# EAGLE design db9neogeo (EAGLE 9.0.0)
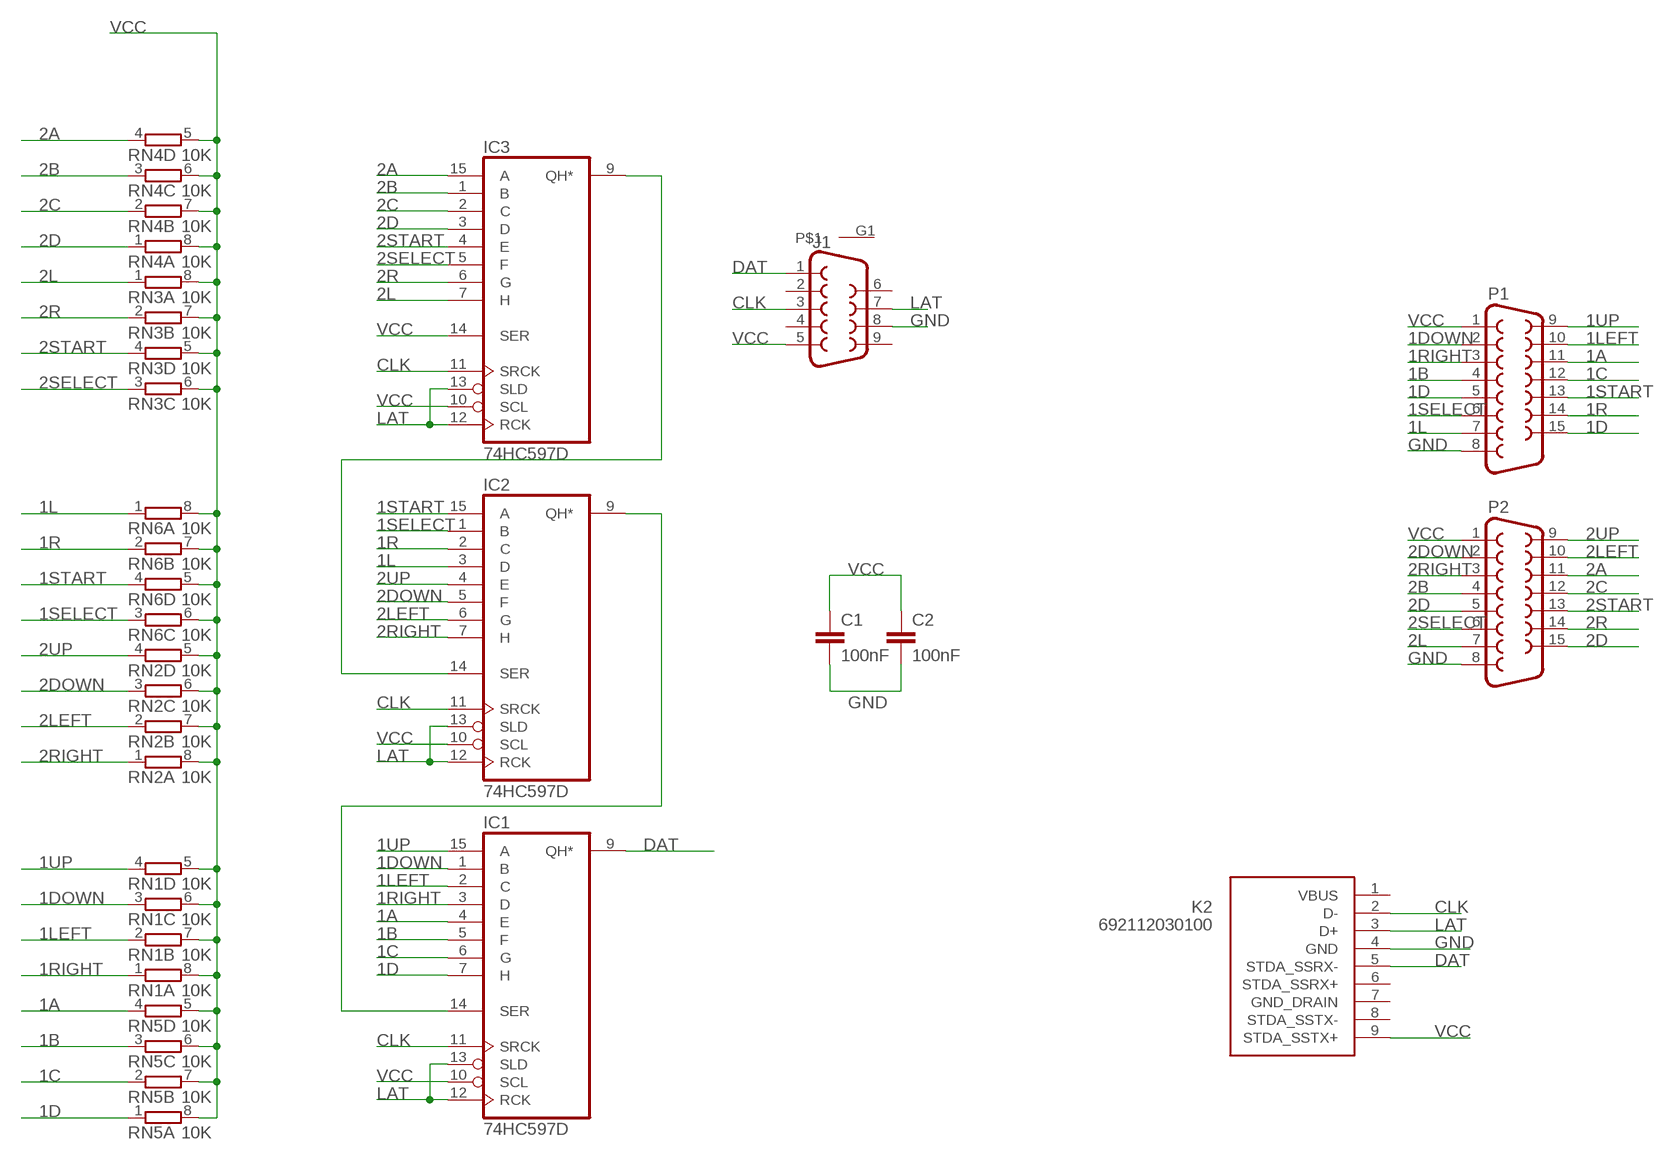
[diagram p0: schematic, sheet 1]

## Parts
C1  100nF  C-EUC0603K  [C0603K]
C2  100nF  C-EUC0603K  [C0603K]
IC1  74HC597D  [SO16]
IC2  74HC597D  [SO16]
IC3  74HC597D  [SO16]
J1  DB9FEMALE  [DB9]
K2  692112030100  [692112030100]
P1  F15HP  [F15HP]
P2  F15HP  [F15HP]
RN1  10K  4R-N0603-ARC  [0603-ARC]
RN2  10K  4R-N0603-ARC  [0603-ARC]
RN3  10K  4R-N0603-ARC  [0603-ARC]
RN4  10K  4R-N0603-ARC  [0603-ARC]
RN5  10K  4R-N0603-ARC  [0603-ARC]
RN6  10K  4R-N0603-ARC  [0603-ARC]

## Nets
1A: IC1.4(E) P1.11 RN5.4
1B: IC1.5(F) P1.4 RN5.3
1C: IC1.6(G) P1.12 RN5.2
1D: IC1.7(H) P1.5 P1.15 RN5.1
1DOWN: IC1.1(B) P1.2 RN1.3
1L: IC2.3(D) P1.7 RN6.1
1LEFT: IC1.2(C) P1.10 RN1.2
1R: IC2.2(C) P1.14 RN6.2
1RIGHT: IC1.3(D) P1.3 RN1.1
1SELECT: IC2.1(B) P1.6 RN6.3
1START: IC2.15(A) P1.13 RN6.4
1UP: IC1.15(A) P1.9 RN1.4
2A: IC3.15(A) P2.11 RN4.4
2B: IC3.1(B) P2.4 RN4.3
2C: IC3.2(C) P2.12 RN4.2
2D: IC3.3(D) P2.5 P2.15 RN4.1
2DOWN: IC2.5(F) P2.2 RN2.3
2L: IC3.7(H) P2.7 RN3.1
2LEFT: IC2.6(G) P2.10 RN2.2
2R: IC3.6(G) P2.14 RN3.2
2RIGHT: IC2.7(H) P2.3 RN2.1
2SELECT: IC3.5(F) P2.6 RN3.3
2START: IC3.4(E) P2.13 RN3.4
2UP: IC2.4(E) P2.9 RN2.4
CLK: IC1.11(SRCK) IC2.11(SRCK) IC3.11(SRCK) J1.3 K2.2(D-)
DAT: IC1.9(QH*) J1.1 K2.5(STDA_SSRX-)
GND: C1.2 C2.2 J1.8 K2.4(GND) P1.8 P2.8
LAT: IC1.12(RCK) IC1.13(SLD) IC2.12(RCK) IC2.13(SLD) IC3.12(RCK) IC3.13(SLD) J1.7 K2.3(D+)
N$1: IC1.14(SER) IC2.9(QH*)
N$7: IC2.14(SER) IC3.9(QH*)
VCC [VCC]: C1.1 C2.1 IC1.10(SCL) IC2.10(SCL) IC3.10(SCL) IC3.14(SER) J1.5 K2.9(STDA_SSTX+) P1.1 P2.1 RN1.5 RN1.6 RN1.7 RN1.8 RN2.5 RN2.6 RN2.7 RN2.8 RN3.5 RN3.6 RN3.7 RN3.8 RN4.5 RN4.6 RN4.7 RN4.8 RN5.5 RN5.6 RN5.7 RN5.8 RN6.5 RN6.6 RN6.7 RN6.8
Unconnected: J1.2 J1.4 J1.6 J1.9 J1.G1 K2.1(VBUS) K2.6(STDA_SSRX+) K2.7(GND_DRAIN) K2.8(STDA_SSTX-)

## Power pins joined to a net without a drawn wire
GND: IC1.8(GND) IC2.8(GND) IC3.8(GND)
VCC: IC1.16(VCC) IC2.16(VCC) IC3.16(VCC)

## Library data of the parts
C1 C2 = rcl:C-EU: CAPACITOR, European symbol
IC1-IC3 = 74xx-eu:74*597: 8-bit SHIFT REGISTER, input latch
J1 = SparkFun-Connectors:DB9: DB9 Connector Standard DB9 (D-Sub 9) serial connector. Can be used for CAN bus as well as RS485 and RS232. Footprint production proven. Here is the female version connector we sell at SparkFun: 9 Pin Female Serial Connector - PCB Mount <https://www.sparkfun.com/products/429> (PRT-00429) This connector has been used on the following SparkFun products: SparkFun RS232 Shifter - SMD <https://www.sparkfun.com/products/449> (PRT-00449) SparkFun RS232 Shifter SMD (No DB9) <https://www.sparkfun.com/products/8780> (PRT-08780); PROD_ID: CONN-08194
K2 = Wuerth_Elektronik_eiCan_Communication_Connectors_STENCIL:692112030100: WR-COM USB 3.0 SMT PLUG WITH CLIPTYPE A
P1 P2 = con-subd:F15: SUB-D; OC_FARNELL: unknown; OC_NEWARK: unknown
RN1-RN6 = resistor-dil:4R-N: Array Chip Resistor Source: RS Component / Phycomp; OC_FARNELL: unknown; OC_NEWARK: unknown

## Net classes
1 power: width 0.305 mm, clearance 0.178 mm to class 0, clearance 0.229 mm
2 VCC: width 0.254 mm

## Board
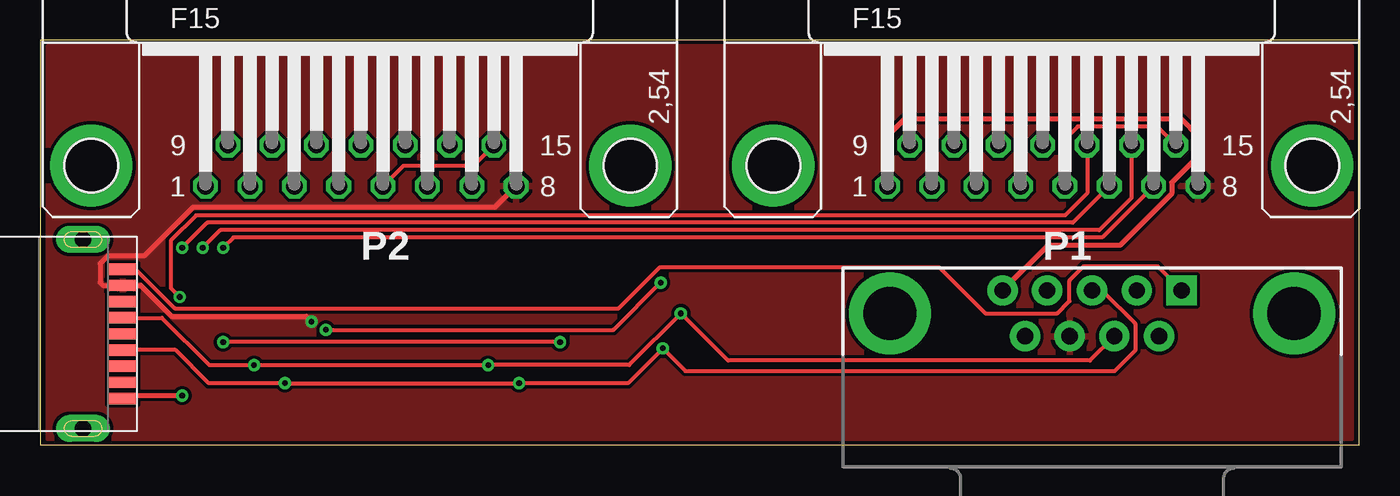
[diagram p1: board, top side]
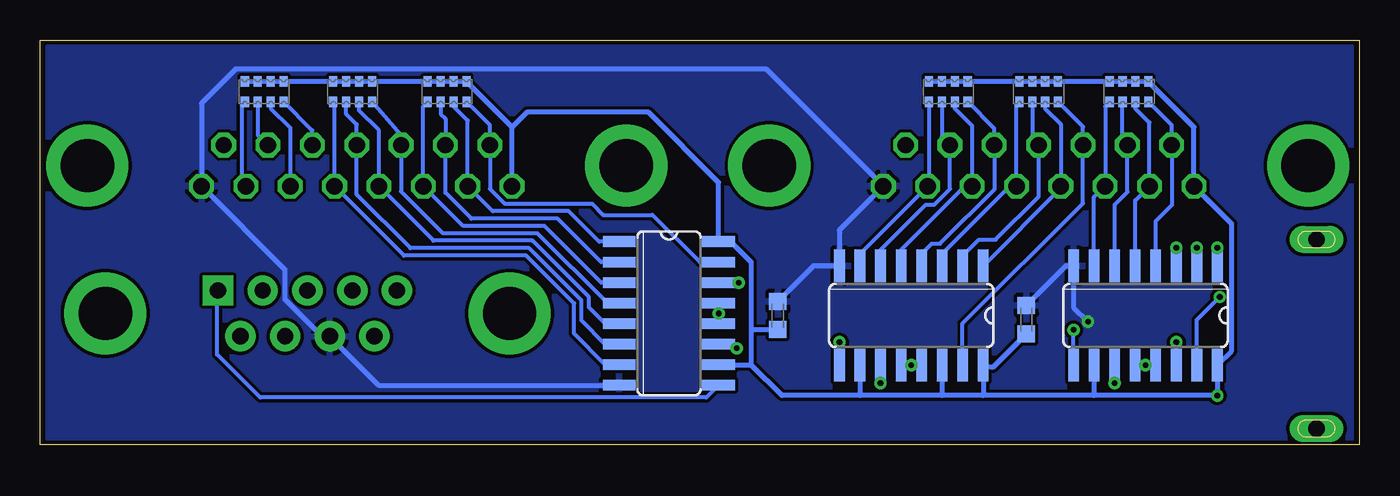
[diagram p2: board, bottom side, seen from below]

Size 81.53 x 25.02 mm. Coordinates in mm from the lower left corner, seen from the top.
Outline: 81.53,25.02 0,25.02 0,0 81.53,0 81.53,25.02
Copper layers (1*16): Top 0.035mm / dielectric 1.5mm / Bottom 0.035mm
Design rules "default *": minimum track width 10mil, minimum drill 24mil, track to track 8mil, track to pad 8mil, pad to pad 8mil, via to via 8mil, smd to smd 8mil, copper to edge 10mil, drill to drill 8mil, minimum pad ring 10mil, minimum via ring 8mil, stop-mask expansion 4mil, vias tented up to drill 0mil, thermal gap 10mil

### Footprints (pad centres in the part's own frame; a part is rotated, then mirrored left to right if it is on the bottom)
C0603K = smd 1.05 x 1.08: 1 -0.875,0; 2 0.875,0
SO16 = smd 0.66 x 2.032: 1 -4.445,-3.073; 2 -3.175,-3.073; 3 -1.905,-3.073; 4 -0.635,-3.073; 5 0.635,-3.073; 6 1.905,-3.073; 7 3.175,-3.073; 8 4.445,-3.073; 9 4.445,3.073; 10 3.175,3.073; 11 1.905,3.073; 12 0.635,3.073; 13 -0.635,3.073; 14 -1.905,3.073; 15 -3.175,3.073; 16 -4.445,3.073
DB9 = drill 1.016 pad 1.88 square: 1 -5.54,-1.42 | drill 1.016 pad 1.88: 2 -2.77,-1.42; 3 0,-1.42; 4 2.77,-1.42; 5 5.54,-1.42; 6 -4.15,1.42; 7 -1.38,1.42; 8 1.38,1.42; 9 4.15,1.42 | drill 3.302 pad 5.08: G1 -12.5,0; G2 12.5,0
692112030100 = smd 0.7 x 1.8: 1 -3,0; 2 -1,0; 3 1,0; 4 3,0; 5 4,0; 6 2,0; 7 0,0; 8 -2,0; 9 -4,0 | drill 1 pad 1.676 long: Z1 5.85,2.45; Z2 -5.85,2.45
F15HP = drill 1.016 octagon: 1 -9.601,-1.27; 2 -6.858,-1.27; 3 -4.115,-1.27; 4 -1.372,-1.27; 5 1.372,-1.27; 6 4.115,-1.27; 7 6.858,-1.27; 8 9.601,-1.27; 9 -8.23,1.27; 10 -5.486,1.27; 11 -2.743,1.27; 12 0,1.27; 13 2.743,1.27; 14 5.486,1.27; 15 8.23,1.27 | drill 3.302 pad 5.08: G1 -16.662,0; G2 16.662,0
0603-ARC = smd 0.5 x 0.65: 1 -1.2,-0.625; 2 -0.4,-0.625; 3 0.4,-0.625; 4 1.2,-0.625; 5 1.2,0.625; 6 0.4,0.625; 7 -0.4,0.625; 8 -1.2,0.625

### Placement (x,y rotation side)
C1  35.94,8 90 bottom
C2  20.57,7.75 90 bottom
IC1  42.67,8.13 270 bottom
IC2  13.21,8 180 bottom
IC3  27.69,8 180 bottom
J1  65.02,8.13 180 top
K2  5.08,6.86 90 top
P1  61.98,17.27 0 top
P2  19.81,17.27 0 top
RN1  56.39,21.84 0 bottom
RN2  14.22,21.84 0 bottom
RN3  25.4,21.84 0 bottom
RN4  19.81,21.84 0 bottom
RN5  62.23,21.84 0 bottom
RN6  67.69,21.84 0 bottom

### Tracks (layer width: path | path; a pad name or v marks a point on that pad's centre or on a via)
1A
  Bottom 0.254: 46.61,8.76 IC1.4 46.48,8.76 50.8,13.08 56.64,13.08 59.23,15.67 P1.11 59.23,19.17 RN5.4
1B
  Bottom 0.254: IC1.5 46.61,7.49 47.62,8.51 47.62,9.13 51.12,12.62 57.23,12.62 P1.4 60.6,19.46 61.83,20.68 RN5.3
1C
  Bottom 0.254: IC1.6 46.61,6.22 48.08,7.7 48.08,8.94 51.31,12.17 58.65,12.17 61.98,15.49 P1.12 61.98,19.81 62.63,20.47 RN5.2
1D
  Top 0.254: P1.15 69.06,19.68 64.14,19.68 63.35,18.9 P1.5
  Bottom 0.254: IC1.7 46.61,4.95 48.54,6.88 48.54,8.75 51.49,11.71 59.05,11.71 P1.5 63.35,21.14 RN5.1
1DOWN
  Bottom 0.254: 45.97,12.57 IC1.1 46.99,12.57 48.87,14.45 53.57,14.45 P1.2 55.12,20.07 55.99,20.94 RN1.3
1L  (via drill 0.35)
  Top 0.254: P1.7 65.66,12.83 11.94,12.83 v11.3,12.19
  Bottom 0.254: P1.7 69.09,16.26 69.09,21.02 RN6.1 | v11.3,12.19 IC2.3
1LEFT
  Bottom 0.254: RN1.2 56.79,20.47 56.49,20.17 P1.10 56.49,15.6 54.89,13.99 49.55,13.99 46.86,11.3 IC1.2
1R  (via drill 0.35)
  Top 0.254: P1.14 67.46,15.28 65.47,13.28 11.12,13.28 v10.03,12.19
  Bottom 0.254: RN6.2 68.09,19.17 P1.14 | v10.03,12.19 IC2.2
1RIGHT
  Bottom 0.254: RN1.1 57.86,20.95 P1.3 55.4,13.54 50.37,13.54 46.86,10.03 IC1.3
1SELECT  (via drill 0.35)
  Top 0.254: P1.6 63.83,13.74 10.31,13.74 v8.76,12.19
  Bottom 0.254: RN6.3 67.29,20.81 66.09,19.61 P1.6 | v8.76,12.19 IC2.1
1START  (via drill 0.35)
  Top 0.254: P1.13 64.72,15.57 63.35,14.2 9.63,14.2 8.05,12.63 8.05,9.7 v8.61,9.14
  Bottom 0.254: P1.13 64.72,19.45 RN6.4 | IC2.15 10.03,7.72 v8.61,9.14
1UP
  Bottom 0.254: RN1.4 53.75,19.78 P1.9 53.75,15.83 52.83,14.91 47.42,14.91 46.74,14.22 43.69,14.22 40.77,11.3 IC1.15
2A
  Bottom 0.254: IC3.15 24.51,7.49 17.07,14.94 P2.11 17.07,19.68 RN4.4
2B
  Bottom 0.254: 18.44,15.75 18.44,15.88 | 18.44,15.88 P2.4 18.44,19.84 19.41,20.81 RN4.3 | IC3.1 18.44,15.88
2C
  Bottom 0.254: RN4.2 20.21,18.94 P2.12 19.81,15.37 22.48,12.7 23.5,12.7 24.51,11.68 IC3.2
2D
  Top 0.254: P2.5 22.45,17.27 26.77,17.27 P2.15
  Bottom 0.254: 21.21,16 21.59,16 25.78,11.81 IC3.3 | RN4.1 21.21,21.02 21.21,16 | 21.21,16 P2.5
2DOWN
  Bottom 0.254: IC2.5 13.84,15.11 P2.2 12.95,19.94 13.82,20.81 RN2.3
2L
  Bottom 0.254: IC3.7 30.86,11.81 P2.7 26.6,16.07 RN3.1
2LEFT
  Bottom 0.254: IC2.6 15.11,14.86 14.33,15.65 P2.10 14.62,18.84 RN2.2
2R
  Bottom 0.254: RN3.2 25.8,19.04 P2.14 25.3,15.83 26.27,14.86 26.8,14.86 29.59,12.06 IC3.6
2RIGHT
  Bottom 0.254: IC2.7 16.38,15.32 P2.3 15.7,20.95 RN2.1
2SELECT
  Bottom 0.254: RN3.3 25,20.81 23.93,19.74 P2.6 24.38,16 28.32,12.06 IC3.5
2START
  Bottom 0.254: RN3.4 22.55,19.57 P2.13 22.55,15.8 25.91,12.45 26.42,12.45 27.05,11.81 IC3.4
2UP
  Bottom 0.254: IC2.4 12.57,13.84 11.56,14.86 11.56,18.52 P2.9 11.58,19.78 RN2.4
CLK  (via drill 0.35)
  Top 0.254: J1.3 65.64,9.55 67.69,7.49 67.69,5.84 66.42,4.57 39.88,4.57 v38.48,5.97 36.32,3.81 v29.59,3.81 v15.11,3.81 10.41,3.81 8.37,5.86 K2.2
  Bottom 0.254: IC2.11 v15.11,3.81 | v29.59,3.81 IC3.11 | IC1.11 38.73,6.22 v38.48,5.97
DAT
  Top 0.254: K2.5 5.89,10.86 8.31,8.44 35.76,8.44 38.32,11 55.55,11 58.42,8.13 62.87,8.13 63.63,8.89 63.63,10.16 64.52,11.05 69.06,11.05 J1.1
  Bottom 0.254: IC1.9 40.36,2.92 67.94,2.92 70.61,5.59 70.61,9.5 J1.1
GND  (via drill 0.35)
  Top 0.305: P2.8 28.09,14.68 9.43,14.68 6.43,11.68 4.15,11.68 3.68,11.21 3.68,10.03 3.86,9.86 K2.4 6.21,9.86 8.11,7.95 16.43,7.95 v16.76,7.62
  Bottom 0.305: C2.2 18.12,11.07 IC2.8 17.65,8.51 v16.76,7.62 | C1.2 33.74,11.07 IC3.8 32.13,13.28 P2.8 36.65,23.24 69.47,23.24 71.58,21.13 P1.8 66.42,10.85 66.42,9.02 64.11,6.71 J1.8 60.62,3.68 IC1.8
  pour Top: 0.51,0.38 81.03,0.38 81.03,24.64 0.51,24.64
  pour Bottom: 0.51,0.38 81.03,0.38 81.03,24.64 0.51,24.64
LAT  (via drill 0.35)
  Top 0.254: J1.7 64.9,5.21 42.52,5.21 v39.6,8.13 36.4,4.93 v27.69,4.93 v13.21,4.93 10.44,4.93 7.51,7.86 K2.3
  Bottom 0.254: 28.32,5.46 IC3.12 | 27.81,4.93 v27.69,4.93 | 39.6,8.26 v39.6,8.13
  Bottom 0.305: IC2.13 v13.21,4.93 IC2.12 | IC3.12 27.81,4.93 | v27.69,4.93 IC3.13 | IC1.12 v39.6,8.13 | IC1.13 39.6,8.26
N$1  (via drill 0.35)
  Top 0.254: v17.65,7.11 35.43,7.11 v38.35,10.03
  Bottom 0.254: IC2.9 v17.65,7.11 | v38.35,10.03 IC1.14
N$7  (via drill 0.35)
  Top 0.254: v32.13,6.35 v11.3,6.35
  Bottom 0.254: IC2.14 v11.3,6.35 | IC3.9 v32.13,6.35
VCC  (via drill 0.35)
  Top 0.305: P1.1 52.38,19.1 53.44,20.17 70.51,20.17 71.63,19.05 71.63,17.91 69.95,16.23 69.95,15.54 66.76,12.34 62.28,12.34 J1.5 | K2.9 5.27,3.05 v8.76,3.05
  Bottom 0.305: 16.38,3.05 23.24,3.05 | 23.24,3.05 25.78,3.05 | 25.78,3.05 30.86,3.05 | 30.86,3.05 35.69,3.05 37.59,4.95 | IC1.10 37.59,4.95 | IC3.10 30.86,3.05 | IC3.14 25.78,3.05 | C2.1 22.64,4.8 IC3.16 23.24,3.05 | IC2.10 16.38,3.05 | RN3.8 RN3.7 RN3.6 RN3.5 RN4.8 RN4.7 RN4.6 RN4.5 RN2.8 RN2.7 RN2.6 RN2.5 10.21,19.66 P2.1 7.87,13.66 7.87,5.82 IC2.16 v8.76,3.05 16.38,3.05 | 37.59,7.11 37.59,11.3 38.86,12.57 IC1.16 39.6,16.23 43.94,20.57 51.46,20.57 52.38,19.66 | 37.59,7.11 37.59,4.95 | C1.1 35.95,7.11 37.59,7.11 | P1.1 52.38,19.66 | 52.38,19.66 RN1.5 RN1.6 RN1.7 RN1.8 RN5.5 RN5.6 RN5.7 RN5.8 RN6.5 RN6.6 RN6.7 RN6.8

### Text on the board
tNames: P2 | P1